# Altium schematic sheet Sheet3.SchDoc
size A
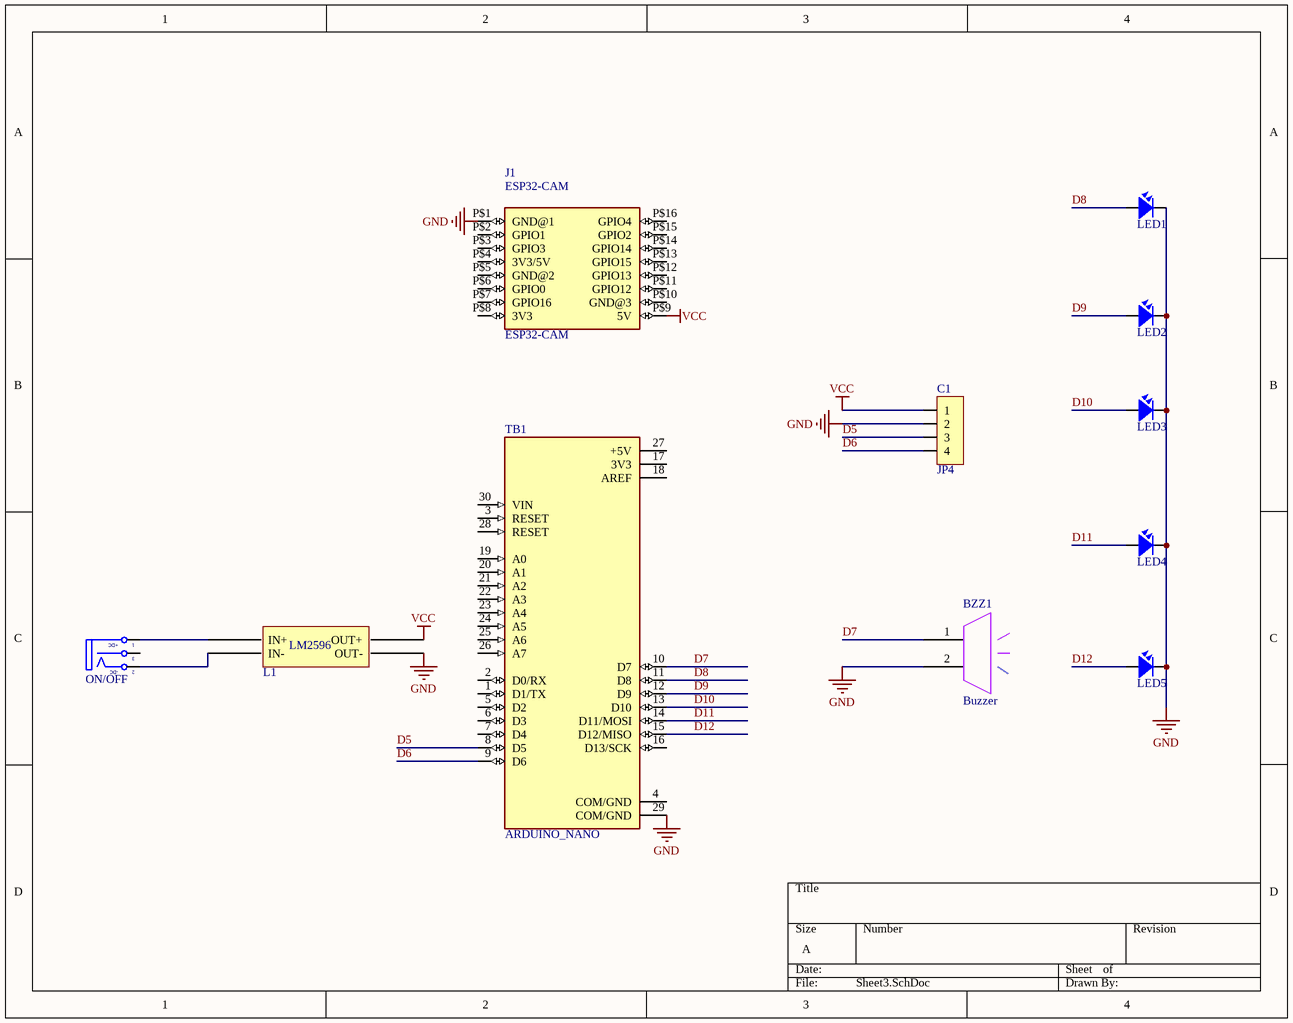
[diagram p0: Sheet3.SchDoc]

## Parts
BZZ1  Buzzer  [BUZZER_12.0X8.5MM]
C1  JP4  [JP4-C1T]
J1  ESP32-CAM  [ESP32-CAM]
L1  BUCK_LM2596  [BUCK_LM2596]  (value not drawn)
LED1  LED  [LED-3MM-YELLOW]  (value not drawn)
LED2  LED  [LED-3MM-YELLOW]  (value not drawn)
LED3  LED  [LED-3MM-YELLOW]  (value not drawn)
LED4  LED  [LED-3MM-YELLOW]  (value not drawn)
LED5  LED  [LED-3MM-YELLOW]  (value not drawn)
ON/OFF  POWER  [DC-IN]  (value not drawn)
TB1  ARDUINO_NANO  [SHIELD_ARDUINO_NANO]

## Nets
GND: BZZ1.2 C1.2 J1.P$1(GND@1) L1.3(OUT-) LED1.2 LED2.2 LED3.2 LED4.2 LED5.2 TB1.29(COM/GND)
VCC: C1.1 J1.P$9(5V) L1.4(OUT+)
D5: C1.3 TB1.8(D5)
D6: C1.4 TB1.9(D6)
D7: BZZ1.1 TB1.10(D7)
D8: LED1.1 TB1.11(D8)
D9: LED2.1 TB1.12(D9)
D10: LED3.1 TB1.13(D10)
D11: LED4.1 TB1.14(D11/MOSI)
D12: LED5.1 TB1.15(D12/MISO)
NetL1_1: L1.1(IN+) ON/OFF.1(T)
NetL1_2: L1.2(IN-) ON/OFF.2(TN)

Not connected (* = marked no-connect by the designer): J1 P$2(GPIO1) P$3(GPIO3) P$4(3V3/5V) P$5(GND@2) P$6(GPIO0) P$7(GPIO16) P$8(3V3) P$10(GND@3) P$11(GPIO12) P$12(GPIO13) P$13(GPIO15) P$14(GPIO14) P$15(GPIO2) P$16(GPIO4); ON/OFF 3(S); TB1 1(D1/TX) 2(D0/RX) 3(RESET) 4(COM/GND) 5(D2) 6(D3) 7(D4) 16(D13/SCK) 17(3V3) 18(AREF) 19(A0) 20(A1) 21(A2) 22(A3) 23(A4) 24(A5) 25(A6) 26(A7) 27(+5V) 28(RESET) 30(VIN)

## Notes on the sheet
- (in symbol BUCK_LM2596) LM2596
- (in symbol DCIN) +DC; -DC

## Library data of the parts
C1 = JP4: WR-PHD 2.54 mm Angled Socket Header; Manufacturer: W¨¹rth Elektronik eiSos GmbH; partNo: 613004143121; ComponentLink1 Description: Manufacturer; ComponentLink2 Description: Datasheet; NoPins: 04; Created Date: 29 March 2013; ComponentLink1URL: http://www.we-online.com; ComponentLink2URL: http://katalog.we-online.de/em/datasheet/6130xx143121.pdf; Created by: Karrer Zheng
J1 = ESP32-CAM: ESP32 ESP32 Transceiver; 802.11 a/b/g/n (Wi-Fi, WiFi, WLAN), BluetoothÂ® Smart 4.x Low Energy (BLE) Evaluation Board; MF: AI-Thinker; SnapEDA_Link: https://www.snapeda.com/parts/ESP32-CAM/AI-Thinker/view-part/?ref=snap; Package: None; Value: *; MP: ESP32-CAM; Check_prices: https://www.snapeda.com/parts/ESP32-CAM/AI-Thinker/view-part/?ref=eda
LED1-LED5 = LED: LED Single colour Green and Red; Value: LED 3 ly Single Colour
ON/OFF = DCIN
TB1 = ARDUINO_NANO: Small, complete, and breadboard-friendly board based on the ATmega328 (Arduino Nano 3.x); Check_prices: https://www.snapeda.com/parts/Arduino%20Nano/Arduino/view-part/?ref=eda; Value: *; Availability: Not in stock; MP: Arduino Nano; Price: None; Package: Non-Standard Arduino; SnapEDA_Link: https://www.snapeda.com/parts/Arduino%20Nano/Arduino/view-part/?ref=snap; MF: Arduino